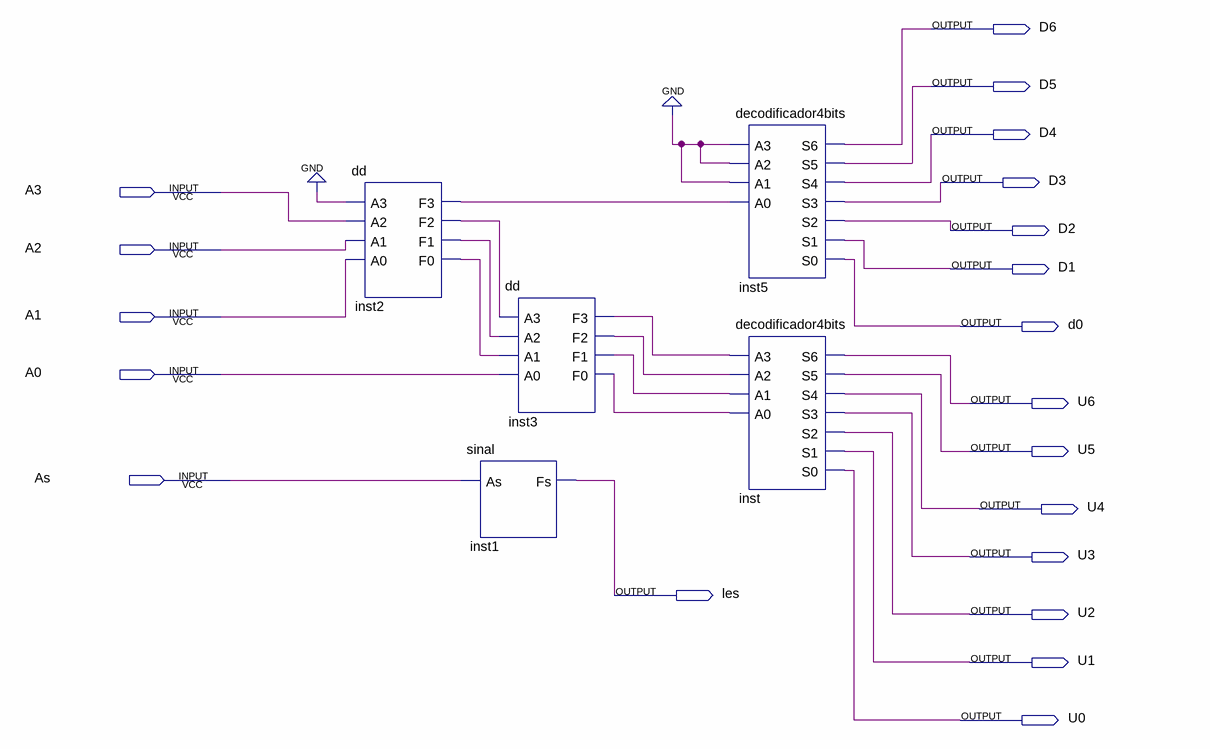
[diagram p0: schematic sheet]
// Quartus schematic deco_entrada_final.bdf as structural Verilog: 5 symbols, 20 pins
module deco_entrada_final (
  input  A3,
  input  A2,
  input  A1,
  input  A0,
  input  As,
  output D6,
  output D5,
  output D4,
  output D3,
  output D2,
  output D1,
  output d0,
  output U6,
  output U5,
  output U4,
  output U3,
  output les,
  output U2,
  output U1,
  output U0
);

  wire inst2_f0, inst2_f1, inst2_f2, inst2_f3, inst3_f0, inst3_f1, inst3_f2, inst3_f3;

  dd inst2 (.A3(1'b0), .A2(A3), .A1(A2), .A0(A1), .F3(inst2_f3), .F2(inst2_f2), .F1(inst2_f1), .F0(inst2_f0));
  dd inst3 (
    .A3(inst2_f2), .A2(inst2_f1), .A1(inst2_f0), .A0(A0), .F3(inst3_f3), .F2(inst3_f2), .F1(inst3_f1),
    .F0(inst3_f0));
  sinal inst1 (.As(As), .Fs(les));
  decodificador4bits inst5 (
    .A3(1'b0), .A2(1'b0), .A1(1'b0), .A0(inst2_f3), .S6(D6), .S5(D5), .S4(D4), .S3(D3), .S2(D2), .S1(D1),
    .S0(d0));
  decodificador4bits inst (
    .A3(inst3_f3), .A2(inst3_f2), .A1(inst3_f1), .A0(inst3_f0), .S6(U6), .S5(U5), .S4(U4), .S3(U3), .S2(U2),
    .S1(U1), .S0(U0));
endmodule
